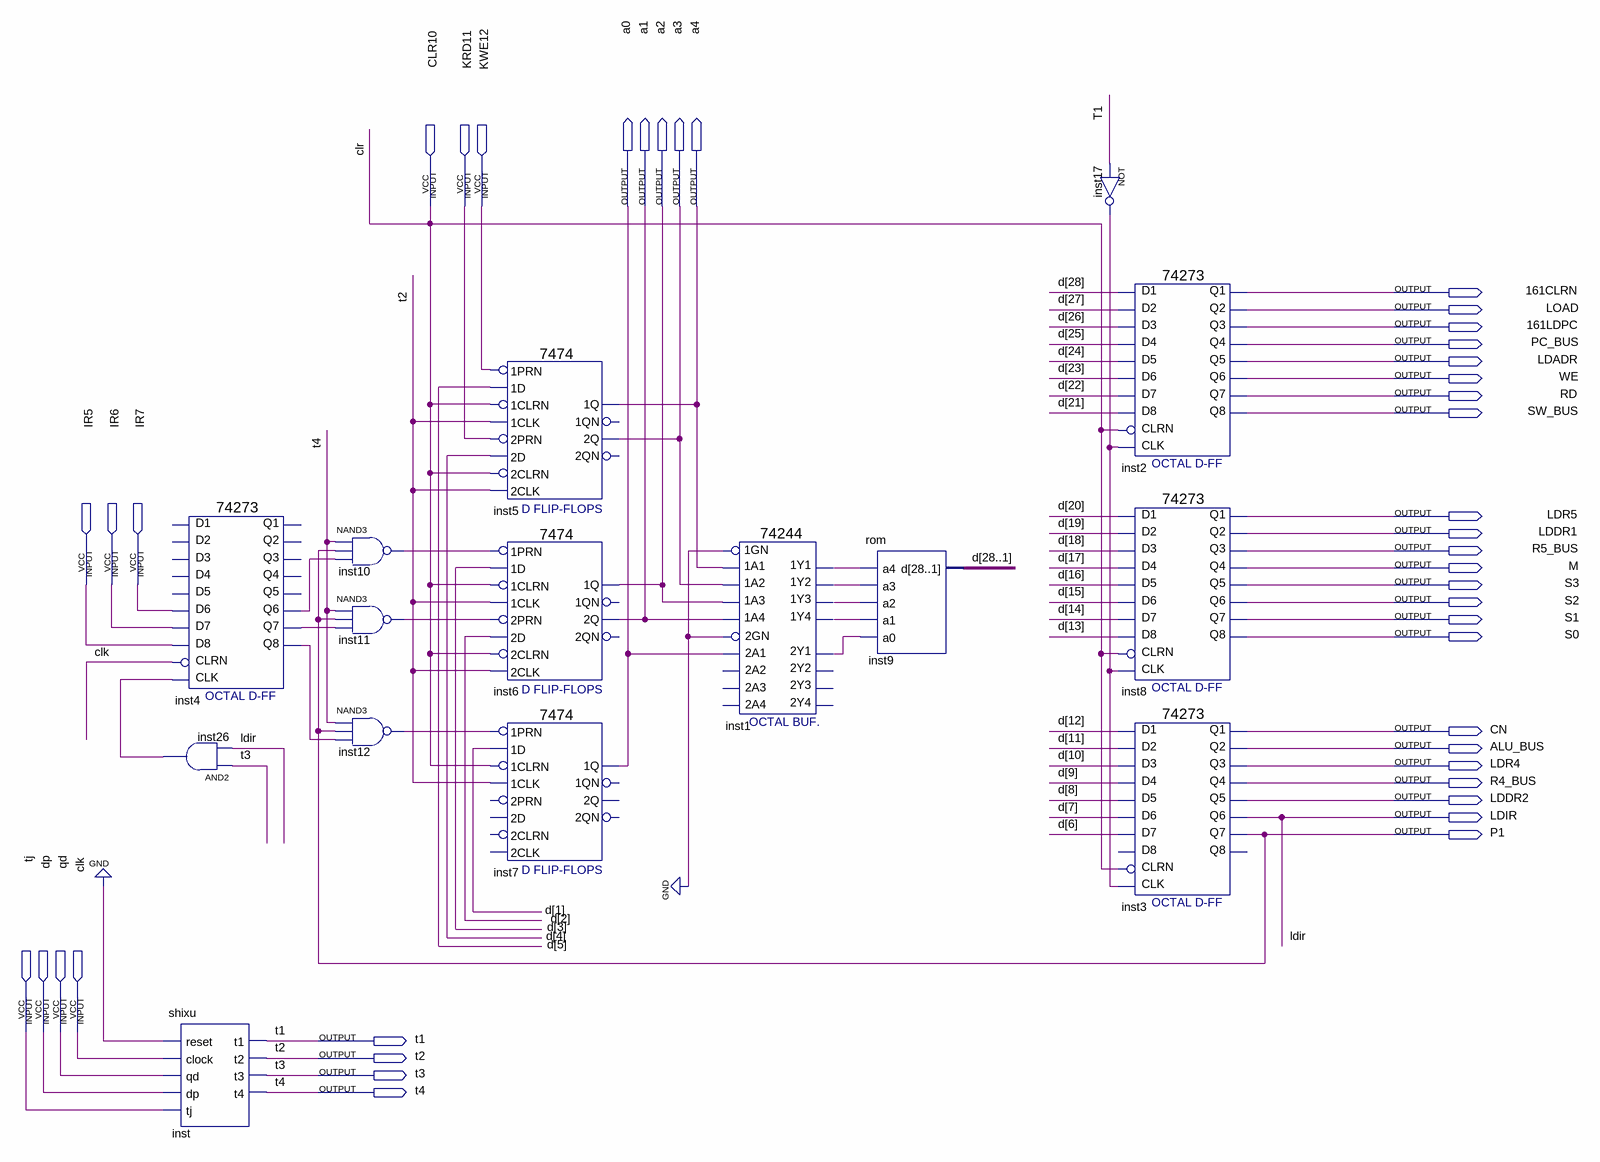
[diagram p0: schematic sheet]
// Quartus schematic control.bdf as structural Verilog: 15 symbols, 42 pins
module control (
  input  CLR10,
  input  KRD11,
  input  KWE12,
  input  IR5,
  input  IR6,
  input  IR7,
  input  tj,
  input  dp,
  input  qd,
  input  clk,
  output a0,
  output a1,
  output a2,
  output a3,
  output a4,
  output \161CLRN ,
  output LOAD,
  output \161LDPC ,
  output PC_BUS,
  output LDADR,
  output WE,
  output RD,
  output SW_BUS,
  output LDR5,
  output LDDR1,
  output R5_BUS,
  output M,
  output S3,
  output S2,
  output S1,
  output S0,
  output CN,
  output ALU_BUS,
  output LDR4,
  output R4_BUS,
  output LDDR2,
  output LDIR,
  output P1,
  output t1,
  output t2,
  output t3,
  output t4
);

  wire inst1_1y1, inst1_1y2, inst1_1y3, inst1_1y4, inst1_2y1, inst4_q6, inst4_q7, inst4_q8, inst10_out,
       inst11_out, inst12_out, inst17_out, inst26_out;
  wire [28:1] d;

  \74273  inst4 (
    .D7(IR6), .D6(IR7), .D8(IR5), .CLK(inst26_out), .CLRN(clk), .Q6(inst4_q6), .Q7(inst4_q7), .Q8(inst4_q8));  // open: D2, D3, D1, D4, D5, Q4, Q1, Q2, Q3, Q5
  and inst26 (inst26_out, t3, LDIR);
  shixu inst (.reset(1'b0), .clock(clk), .qd(qd), .dp(dp), .tj(tj), .t1(t1), .t2(t2), .t3(t3), .t4(t4));
  nand inst10 (inst10_out, t4, P1, inst4_q6);
  nand inst11 (inst11_out, t4, P1, inst4_q7);
  nand inst12 (inst12_out, t4, P1, inst4_q8);
  \7474  inst5 (
    .\2D (d[4]), .\2PRN (KRD11), .\1CLK (t2), .\1D (d[5]), .\1PRN (KWE12), .\2CLK (t2), .\2CLRN (CLR10),
    .\1CLRN (CLR10), .\2Q (a3), .\1Q (a4));  // open: 1QN, 2QN
  \7474  inst6 (
    .\2D (d[2]), .\2PRN (inst11_out), .\1CLK (t2), .\1D (d[3]), .\1PRN (inst10_out), .\2CLK (t2),
    .\2CLRN (CLR10), .\1CLRN (CLR10), .\2Q (a1), .\1Q (a2));  // open: 1QN, 2QN
  \7474  inst7 (
    .\1CLK (t2), .\1D (d[1]), .\1PRN (inst12_out), .\1CLRN (CLR10), .\1Q (a0));  // open: 2D, 2PRN, 2CLK, 2CLRN, 1QN, 2Q, 2QN
  \74244  inst1 (
    .\1A2 (a3), .\1A4 (a1), .\1A1 (a4), .\1A3 (a2), .\1GN (1'b0), .\2GN (1'b0), .\2A1 (a0),
    .\1Y2 (inst1_1y2), .\1Y4 (inst1_1y4), .\2Y1 (inst1_2y1), .\1Y1 (inst1_1y1), .\1Y3 (inst1_1y3));  // open: 2A3, 2A4, 2A2, 2Y3, 2Y4, 2Y2
  rom inst9 (.a4(inst1_1y1), .a3(inst1_1y2), .a2(inst1_1y3), .a1(inst1_1y4), .a0(inst1_2y1), .d(d));
  not inst17 (inst17_out, t1);
  \74273  inst2 (
    .D2(d[27]), .D3(d[26]), .D1(d[28]), .D4(d[25]), .D7(d[22]), .D6(d[23]), .D5(d[24]), .D8(d[21]),
    .CLK(inst17_out), .CLRN(CLR10), .Q4(PC_BUS), .Q1(\161CLRN ), .Q2(LOAD), .Q3(\161LDPC ), .Q6(WE),
    .Q5(LDADR), .Q7(RD), .Q8(SW_BUS));
  \74273  inst8 (
    .D2(d[19]), .D3(d[18]), .D1(d[20]), .D4(d[17]), .D7(d[14]), .D6(d[15]), .D5(d[16]), .D8(d[13]),
    .CLK(inst17_out), .CLRN(CLR10), .Q4(M), .Q1(LDR5), .Q2(LDDR1), .Q3(R5_BUS), .Q6(S2), .Q5(S3), .Q7(S1),
    .Q8(S0));
  \74273  inst3 (
    .D2(d[11]), .D3(d[10]), .D1(d[12]), .D4(d[9]), .D7(d[6]), .D6(d[7]), .D5(d[8]), .CLK(inst17_out),
    .CLRN(CLR10), .Q4(R4_BUS), .Q1(CN), .Q2(ALU_BUS), .Q3(LDR4), .Q6(LDIR), .Q5(LDDR2), .Q7(P1));  // open: D8, Q8

  // Other names for the same wires on the sheet: clr = CLR10
endmodule
